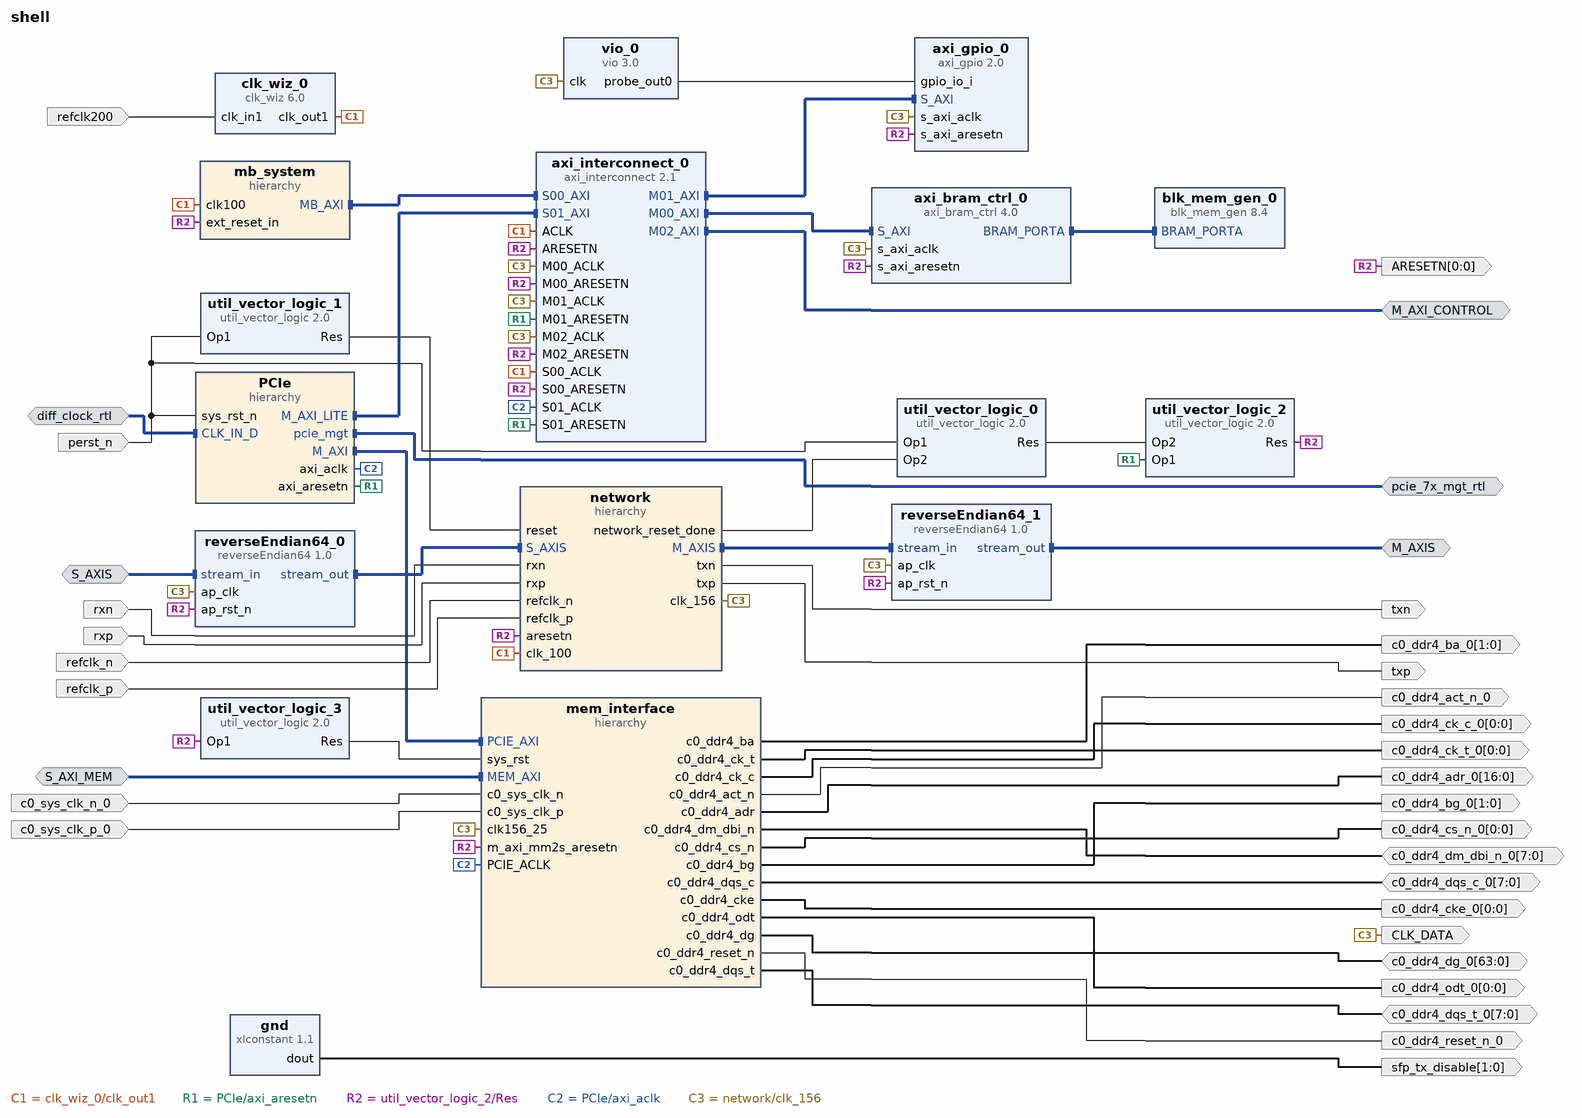
[diagram p0: block diagram of the top level]
# Vivado block design shell, xcku115-flva1517-2-e, Vivado 2018.1
create_bd_design shell

create_bd_intf_port -mode Master -vlnv xilinx.com:interface:pcie_7x_mgt_rtl:1.0 pcie_7x_mgt_rtl
create_bd_intf_port -mode Slave -vlnv xilinx.com:interface:diff_clock_rtl:1.0 diff_clock_rtl
set_property -dict {CONFIG.FREQ_HZ 100000000} [get_bd_intf_ports diff_clock_rtl]
create_bd_intf_port -mode Slave -vlnv xilinx.com:interface:axis_rtl:1.0 S_AXIS
set_property -dict [list \
  CONFIG.TDATA_NUM_BYTES 8 \
  CONFIG.TDEST_WIDTH 0 \
  CONFIG.TID_WIDTH 0 \
  CONFIG.TUSER_WIDTH 0 \
  CONFIG.HAS_TREADY 1 \
  CONFIG.HAS_TSTRB 0 \
  CONFIG.HAS_TKEEP 1 \
  CONFIG.HAS_TLAST 1 \
  CONFIG.LAYERED_METADATA {xilinx.com:interface:datatypes:1.0 {CLK {datatype {name {attribs {resolve_type immediate dependency {} format string minimum {} maximum {}} value {}} bitwidth {attribs {resolve_type immediate dependency {} format long minimum {} maximum {}} value 1} bitoffset {attribs {resolve_type immediate dependency {} format long minimum {} maximum {}} value 0}}} TDATA {datatype {name {attribs {resolve_type immediate dependency {} format string minimum {} maximum {}} value {}} bitwidth {attribs {resolve_type immediate dependency {} format long minimum {} maximum {}} value 64} bitoffset {attribs {resolve_type immediate dependency {} format long minimum {} maximum {}} value 0} integer {signed {attribs {resolve_type immediate dependency {} format bool minimum {} maximum {}} value true}}}} TDATA_WIDTH 64}} \
] [get_bd_intf_ports S_AXIS]
create_bd_intf_port -mode Master -vlnv xilinx.com:interface:aximm_rtl:1.0 M_AXI_CONTROL
set_property -dict [list \
  CONFIG.DATA_WIDTH 32 \
  CONFIG.PROTOCOL AXI4LITE \
  CONFIG.ADDR_WIDTH 32 \
  CONFIG.HAS_BURST 0 \
  CONFIG.HAS_LOCK 0 \
  CONFIG.HAS_CACHE 0 \
  CONFIG.HAS_QOS 0 \
  CONFIG.HAS_REGION 0 \
] [get_bd_intf_ports M_AXI_CONTROL]
create_bd_intf_port -mode Master -vlnv xilinx.com:interface:axis_rtl:1.0 M_AXIS
create_bd_intf_port -mode Slave -vlnv xilinx.com:interface:aximm_rtl:1.0 S_AXI_MEM
set_property -dict [list \
  CONFIG.DATA_WIDTH 512 \
  CONFIG.PROTOCOL AXI4 \
  CONFIG.ID_WIDTH 1 \
  CONFIG.ADDR_WIDTH 32 \
  CONFIG.AWUSER_WIDTH 0 \
  CONFIG.ARUSER_WIDTH 0 \
  CONFIG.WUSER_WIDTH 0 \
  CONFIG.RUSER_WIDTH 0 \
  CONFIG.BUSER_WIDTH 0 \
  CONFIG.READ_WRITE_MODE READ_WRITE \
  CONFIG.HAS_BURST 1 \
  CONFIG.HAS_LOCK 1 \
  CONFIG.HAS_PROT 1 \
  CONFIG.HAS_CACHE 1 \
  CONFIG.HAS_QOS 1 \
  CONFIG.HAS_REGION 1 \
  CONFIG.HAS_WSTRB 1 \
  CONFIG.HAS_BRESP 1 \
  CONFIG.HAS_RRESP 1 \
  CONFIG.SUPPORTS_NARROW_BURST 1 \
  CONFIG.NUM_READ_OUTSTANDING 2 \
  CONFIG.NUM_WRITE_OUTSTANDING 2 \
  CONFIG.MAX_BURST_LENGTH 256 \
  CONFIG.NUM_READ_THREADS 1 \
  CONFIG.NUM_WRITE_THREADS 1 \
  CONFIG.RUSER_BITS_PER_BYTE 0 \
  CONFIG.WUSER_BITS_PER_BYTE 0 \
] [get_bd_intf_ports S_AXI_MEM]
create_bd_port -dir I rxn
create_bd_port -dir I rxp
create_bd_port -dir I refclk_n
create_bd_port -dir O txp
create_bd_port -dir O txn
create_bd_port -dir I refclk_p
create_bd_port -dir I perst_n
create_bd_port -dir I -type clk refclk200
set_property -dict {CONFIG.FREQ_HZ 200000000} [get_bd_ports refclk200]
create_bd_port -dir O -from 1 -to 0 sfp_tx_disable
create_bd_port -dir O -from 0 -to 0 ARESETN
create_bd_port -dir O -type clk CLK_DATA
set_property -dict {CONFIG.ASSOCIATED_BUSIF M_AXIS:S_AXIS:S_AXI_MEM:M_AXI_CONTROL} [get_bd_ports CLK_DATA]
create_bd_port -dir O -from 1 -to 0 c0_ddr4_ba_0
create_bd_port -dir O -from 0 -to 0 -type clk c0_ddr4_ck_t_0
create_bd_port -dir O -from 0 -to 0 -type clk c0_ddr4_ck_c_0
create_bd_port -dir IO -from 7 -to 0 c0_ddr4_dm_dbi_n_0
create_bd_port -dir IO -from 7 -to 0 c0_ddr4_dqs_c_0
create_bd_port -dir O -from 0 -to 0 c0_ddr4_cs_n_0
create_bd_port -dir O -from 0 -to 0 c0_ddr4_odt_0
create_bd_port -dir O c0_ddr4_act_n_0
create_bd_port -dir O -from 1 -to 0 c0_ddr4_bg_0
create_bd_port -dir O -from 16 -to 0 c0_ddr4_adr_0
create_bd_port -dir O c0_ddr4_reset_n_0
create_bd_port -dir O -from 0 -to 0 c0_ddr4_cke_0
create_bd_port -dir IO -from 7 -to 0 c0_ddr4_dqs_t_0
create_bd_port -dir I -type clk c0_sys_clk_n_0
create_bd_port -dir I -type clk c0_sys_clk_p_0
create_bd_port -dir IO -from 63 -to 0 c0_ddr4_dg_0

create_bd_cell -type hier network
create_bd_cell -type ip -vlnv xilinx.com:ip:util_vector_logic:2.0 util_vector_logic_0
set_property -dict {CONFIG.C_SIZE 1} [get_bd_cells util_vector_logic_0]
create_bd_cell -type ip -vlnv xilinx.com:ip:util_vector_logic:2.0 util_vector_logic_1
set_property -dict {CONFIG.C_SIZE 1 CONFIG.C_OPERATION not} [get_bd_cells util_vector_logic_1]
create_bd_cell -type ip -vlnv xilinx.com:ip:clk_wiz:6.0 clk_wiz_0
set_property -dict {CONFIG.USE_LOCKED false CONFIG.USE_RESET false} [get_bd_cells clk_wiz_0]
create_bd_cell -type ip -vlnv xilinx.com:ip:xlconstant:1.1 gnd
set_property -dict {CONFIG.CONST_WIDTH 2 CONFIG.CONST_VAL 0} [get_bd_cells gnd]
create_bd_cell -type hier PCIe
create_bd_cell -type ip -vlnv xilinx.com:ip:util_vector_logic:2.0 util_vector_logic_2
set_property -dict {CONFIG.C_SIZE 1} [get_bd_cells util_vector_logic_2]
create_bd_cell -type hier mb_system
create_bd_cell -type ip -vlnv xilinx.com:ip:axi_interconnect:2.1 axi_interconnect_0
set_property -dict [list \
  CONFIG.NUM_SI 2 \
  CONFIG.NUM_MI 3 \
  CONFIG.ENABLE_ADVANCED_OPTIONS 0 \
  CONFIG.XBAR_DATA_WIDTH 32 \
] [get_bd_cells axi_interconnect_0]
create_bd_cell -type ip -vlnv xilinx.com:ip:axi_bram_ctrl:4.0 axi_bram_ctrl_0
set_property -dict {CONFIG.PROTOCOL AXI4LITE CONFIG.SINGLE_PORT_BRAM 1} [get_bd_cells axi_bram_ctrl_0]
create_bd_cell -type hier mem_interface
create_bd_cell -type ip -vlnv xilinx.com:ip:blk_mem_gen:8.4 blk_mem_gen_0
create_bd_cell -type ip -vlnv xilinx.com:hls:reverseEndian64:1.0 reverseEndian64_0
create_bd_cell -type ip -vlnv xilinx.com:hls:reverseEndian64:1.0 reverseEndian64_1
create_bd_cell -type ip -vlnv xilinx.com:ip:axi_gpio:2.0 axi_gpio_0
create_bd_cell -type ip -vlnv xilinx.com:ip:vio:3.0 vio_0
set_property -dict {CONFIG.C_PROBE_OUT0_WIDTH 32 CONFIG.C_NUM_PROBE_IN 0} [get_bd_cells vio_0]
create_bd_cell -type ip -vlnv xilinx.com:ip:util_vector_logic:2.0 util_vector_logic_3
set_property -dict {CONFIG.C_SIZE 1 CONFIG.C_OPERATION not} [get_bd_cells util_vector_logic_3]

# ---- hierarchy /network ----
current_bd_instance /network
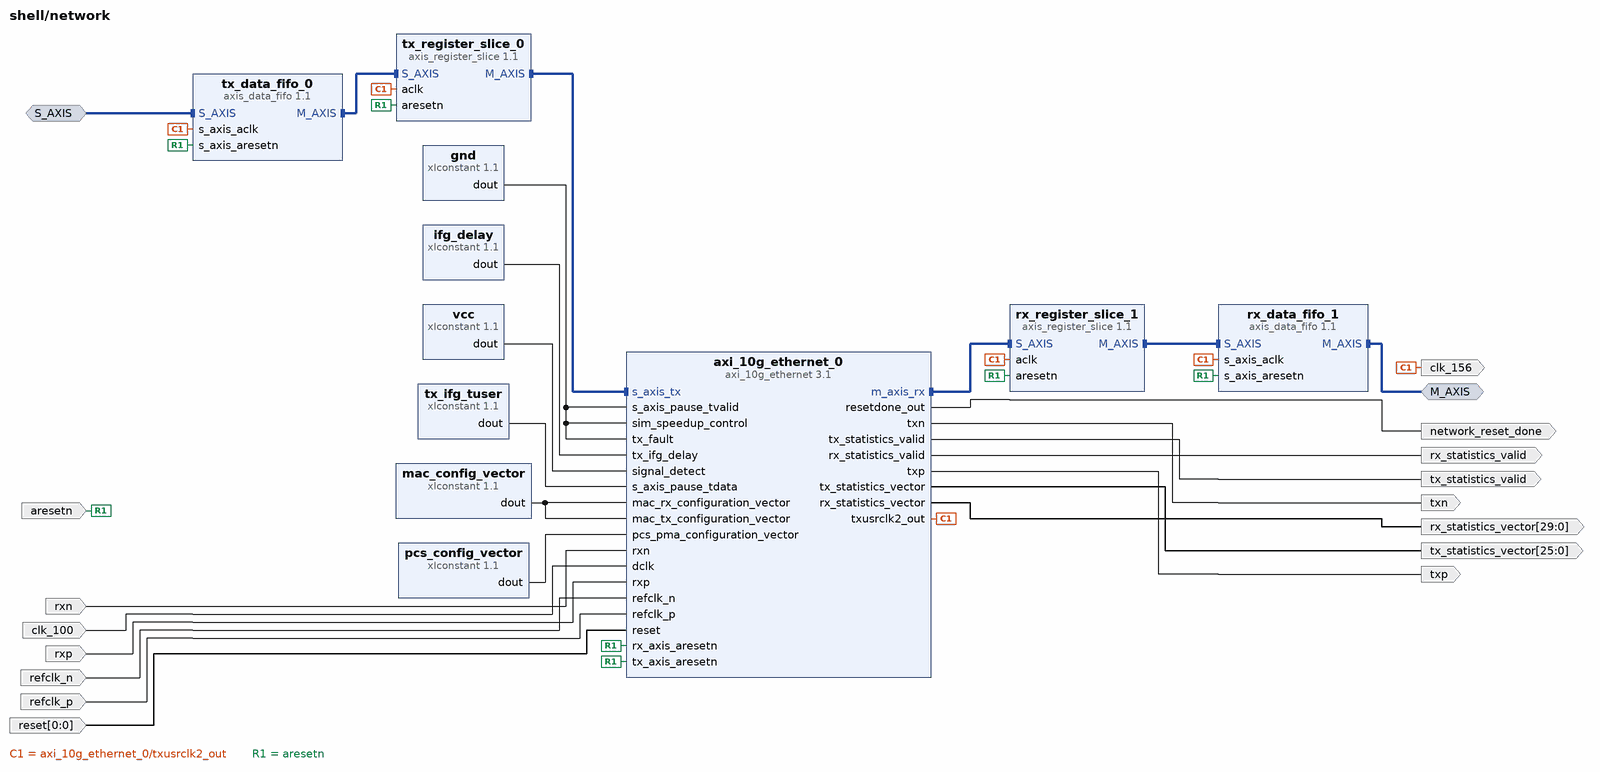
[diagram p1: block diagram inside /network]
create_bd_intf_pin -mode Slave -vlnv xilinx.com:interface:axis_rtl:1.0 S_AXIS
create_bd_intf_pin -mode Master -vlnv xilinx.com:interface:axis_rtl:1.0 M_AXIS
create_bd_pin -dir I rxn
create_bd_pin -dir I -type clk clk_100
create_bd_pin -dir I rxp
create_bd_pin -dir O -type clk clk_156
create_bd_pin -dir I -type rst aresetn
create_bd_pin -dir I refclk_n
create_bd_pin -dir O txp
create_bd_pin -dir O txn
create_bd_pin -dir O network_reset_done
create_bd_pin -dir I refclk_p
create_bd_pin -dir I -from 0 -to 0 -type rst reset
create_bd_pin -dir O tx_statistics_valid
create_bd_pin -dir O -from 25 -to 0 tx_statistics_vector
create_bd_pin -dir O rx_statistics_valid
create_bd_pin -dir O -from 29 -to 0 rx_statistics_vector

create_bd_cell -type ip -vlnv xilinx.com:ip:xlconstant:1.1 gnd
set_property -dict {CONFIG.CONST_VAL 0} [get_bd_cells gnd]
create_bd_cell -type ip -vlnv xilinx.com:ip:axis_register_slice:1.1 tx_register_slice_0
set_property -dict {CONFIG.TUSER_WIDTH 0} [get_bd_cells tx_register_slice_0]
create_bd_cell -type ip -vlnv xilinx.com:ip:axi_10g_ethernet:3.1 axi_10g_ethernet_0
set_property -dict [list \
  CONFIG.Management_Interface false \
  CONFIG.base_kr BASE-R \
  CONFIG.SupportLevel 1 \
  CONFIG.Locations X1Y16 \
] [get_bd_cells axi_10g_ethernet_0]
create_bd_cell -type ip -vlnv xilinx.com:ip:xlconstant:1.1 mac_config_vector
set_property -dict {CONFIG.CONST_WIDTH 80 CONFIG.CONST_VAL 22} [get_bd_cells mac_config_vector]
create_bd_cell -type ip -vlnv xilinx.com:ip:xlconstant:1.1 tx_ifg_tuser
set_property -dict {CONFIG.CONST_WIDTH 16 CONFIG.CONST_VAL 0} [get_bd_cells tx_ifg_tuser]
create_bd_cell -type ip -vlnv xilinx.com:ip:xlconstant:1.1 ifg_delay
set_property -dict {CONFIG.CONST_WIDTH 8 CONFIG.CONST_VAL 0} [get_bd_cells ifg_delay]
create_bd_cell -type ip -vlnv xilinx.com:ip:xlconstant:1.1 vcc
create_bd_cell -type ip -vlnv xilinx.com:ip:xlconstant:1.1 pcs_config_vector
set_property -dict {CONFIG.CONST_WIDTH 536 CONFIG.CONST_VAL 0} [get_bd_cells pcs_config_vector]
create_bd_cell -type ip -vlnv xilinx.com:ip:axis_register_slice:1.1 rx_register_slice_1
set_property -dict {CONFIG.TUSER_WIDTH 0} [get_bd_cells rx_register_slice_1]
create_bd_cell -type ip -vlnv xilinx.com:ip:axis_data_fifo:1.1 rx_data_fifo_1
set_property -dict {CONFIG.FIFO_MODE 2} [get_bd_cells rx_data_fifo_1]
create_bd_cell -type ip -vlnv xilinx.com:ip:axis_data_fifo:1.1 tx_data_fifo_0
set_property -dict {CONFIG.FIFO_MODE 2} [get_bd_cells tx_data_fifo_0]

# ---- hierarchy /PCIe ----
current_bd_instance /PCIe
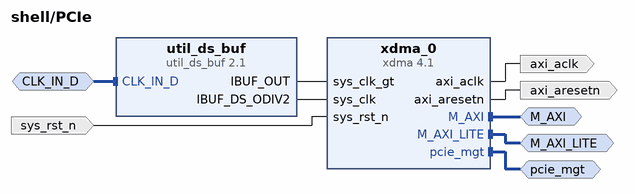
[diagram p2: block diagram inside /PCIe]
create_bd_intf_pin -mode Master -vlnv xilinx.com:interface:pcie_7x_mgt_rtl:1.0 pcie_mgt
create_bd_intf_pin -mode Master -vlnv xilinx.com:interface:aximm_rtl:1.0 M_AXI
create_bd_intf_pin -mode Slave -vlnv xilinx.com:interface:diff_clock_rtl:1.0 CLK_IN_D
create_bd_intf_pin -mode Master -vlnv xilinx.com:interface:aximm_rtl:1.0 M_AXI_LITE
create_bd_pin -dir I -type rst sys_rst_n
create_bd_pin -dir O -type clk axi_aclk
create_bd_pin -dir O -type rst axi_aresetn

create_bd_cell -type ip -vlnv xilinx.com:ip:xdma:4.1 xdma_0
set_property -dict [list \
  CONFIG.mode_selection Advanced \
  CONFIG.pl_link_cap_max_link_width X8 \
  CONFIG.pl_link_cap_max_link_speed 8.0_GT/s \
  CONFIG.axi_data_width 256_bit \
  CONFIG.axisten_freq 250 \
  CONFIG.pf0_device_id 8038 \
  CONFIG.axilite_master_en true \
  CONFIG.pf0_interrupt_pin NONE \
  CONFIG.xdma_rnum_chnl 4 \
  CONFIG.xdma_wnum_chnl 4 \
  CONFIG.INS_LOSS_NYQ 5 \
  CONFIG.xdma_axi_intf_mm AXI_Memory_Mapped \
  CONFIG.cfg_mgmt_if false \
  CONFIG.ins_loss_profile Chip-to-Chip \
] [get_bd_cells xdma_0]
create_bd_cell -type ip -vlnv xilinx.com:ip:util_ds_buf:2.1 util_ds_buf
set_property -dict {CONFIG.C_BUF_TYPE IBUFDSGTE} [get_bd_cells util_ds_buf]

# ---- hierarchy /mb_system ----
current_bd_instance /mb_system
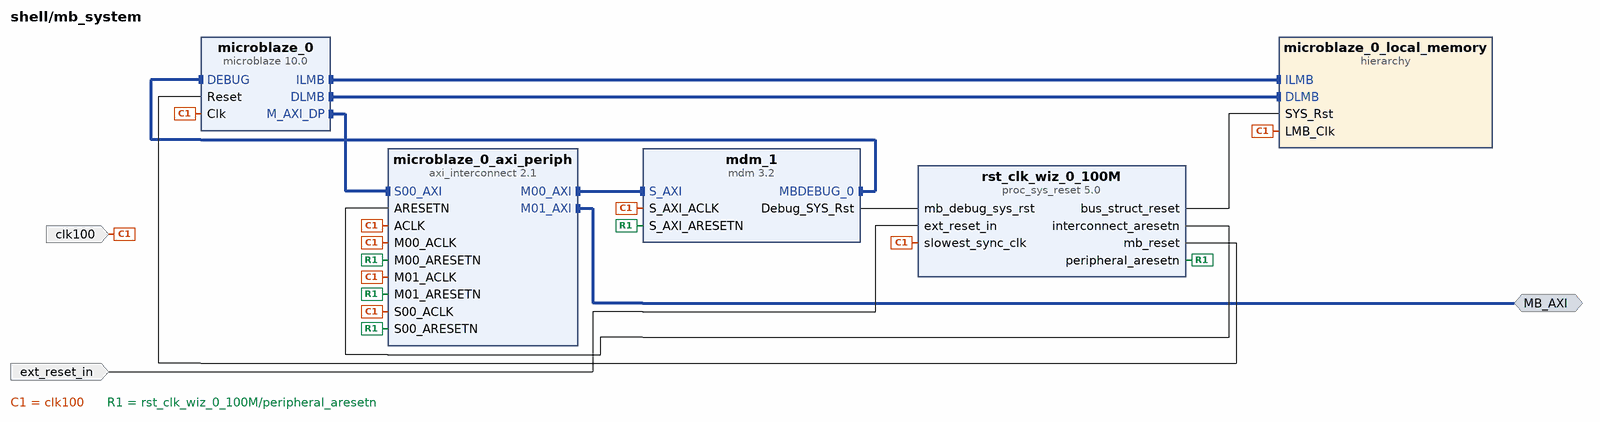
[diagram p3: block diagram inside /mb_system]
create_bd_intf_pin -mode Master -vlnv xilinx.com:interface:aximm_rtl:1.0 MB_AXI
create_bd_pin -dir I -type clk clk100
create_bd_pin -dir I -type rst ext_reset_in

create_bd_cell -type ip -vlnv xilinx.com:ip:mdm:3.2 mdm_1
set_property -dict {CONFIG.C_USE_UART 1} [get_bd_cells mdm_1]
create_bd_cell -type ip -vlnv xilinx.com:ip:proc_sys_reset:5.0 rst_clk_wiz_0_100M
create_bd_cell -type ip -vlnv xilinx.com:ip:axi_interconnect:2.1 microblaze_0_axi_periph
set_property -dict {CONFIG.NUM_MI 2} [get_bd_cells microblaze_0_axi_periph]
create_bd_cell -type ip -vlnv xilinx.com:ip:microblaze:10.0 microblaze_0
set_property -dict {CONFIG.C_D_AXI 1 CONFIG.C_D_LMB 1 CONFIG.C_I_LMB 1 CONFIG.C_DEBUG_ENABLED 1} [get_bd_cells microblaze_0]
create_bd_cell -type hier microblaze_0_local_memory

# ---- hierarchy /mb_system/microblaze_0_local_memory ----
current_bd_instance /mb_system/microblaze_0_local_memory
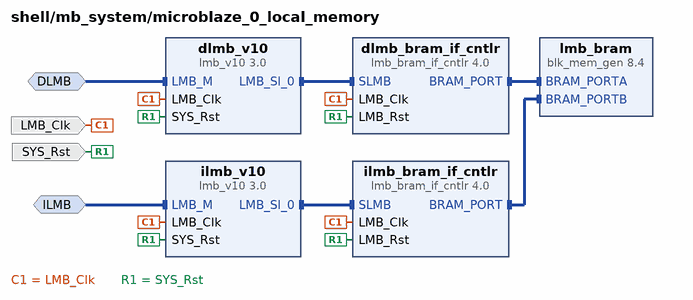
[diagram p4: block diagram inside /mb_system/microblaze_0_local_memory]
create_bd_intf_pin -mode MirroredMaster -vlnv xilinx.com:interface:lmb_rtl:1.0 DLMB
create_bd_intf_pin -mode MirroredMaster -vlnv xilinx.com:interface:lmb_rtl:1.0 ILMB
create_bd_pin -dir I -type clk LMB_Clk
create_bd_pin -dir I -type rst SYS_Rst

create_bd_cell -type ip -vlnv xilinx.com:ip:lmb_v10:3.0 dlmb_v10
create_bd_cell -type ip -vlnv xilinx.com:ip:lmb_v10:3.0 ilmb_v10
create_bd_cell -type ip -vlnv xilinx.com:ip:lmb_bram_if_cntlr:4.0 dlmb_bram_if_cntlr
set_property -dict {CONFIG.C_ECC 0} [get_bd_cells dlmb_bram_if_cntlr]
create_bd_cell -type ip -vlnv xilinx.com:ip:lmb_bram_if_cntlr:4.0 ilmb_bram_if_cntlr
set_property -dict {CONFIG.C_ECC 0} [get_bd_cells ilmb_bram_if_cntlr]
create_bd_cell -type ip -vlnv xilinx.com:ip:blk_mem_gen:8.4 lmb_bram
set_property -dict {CONFIG.Memory_Type True_Dual_Port_RAM CONFIG.use_bram_block BRAM_Controller} [get_bd_cells lmb_bram]

# ---- hierarchy /mem_interface ----
current_bd_instance /mem_interface
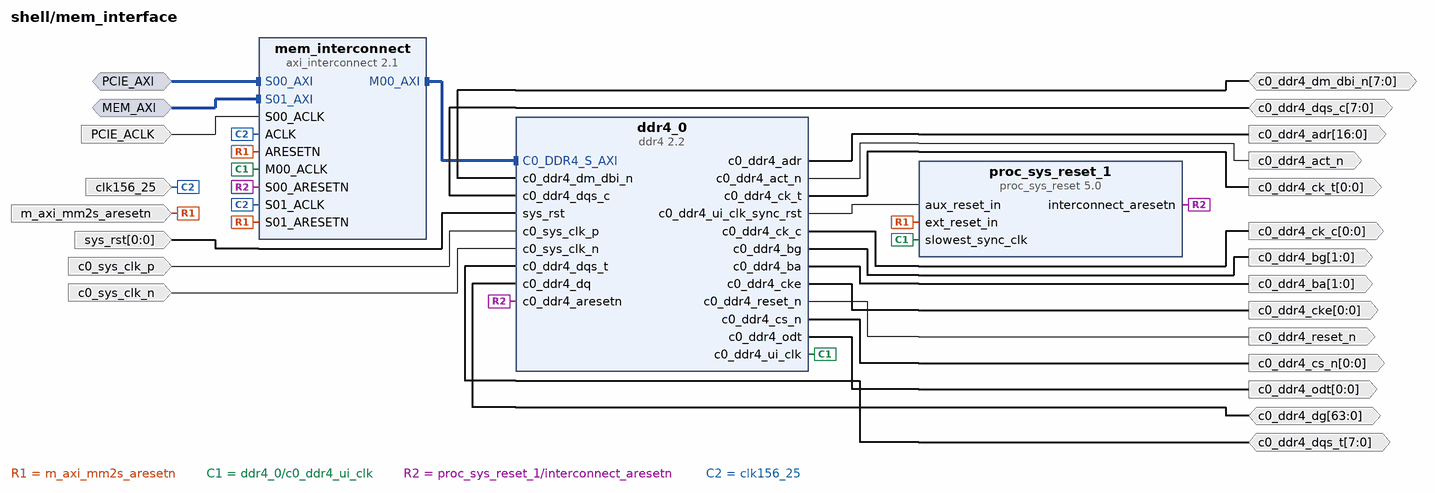
[diagram p5: block diagram inside /mem_interface]
create_bd_intf_pin -mode Slave -vlnv xilinx.com:interface:aximm_rtl:1.0 PCIE_AXI
create_bd_intf_pin -mode Slave -vlnv xilinx.com:interface:aximm_rtl:1.0 MEM_AXI
create_bd_pin -dir O c0_ddr4_reset_n
create_bd_pin -dir I -type clk clk156_25
create_bd_pin -dir O -from 1 -to 0 c0_ddr4_bg
create_bd_pin -dir O -from 0 -to 0 c0_ddr4_odt
create_bd_pin -dir O c0_ddr4_act_n
create_bd_pin -dir O -from 16 -to 0 c0_ddr4_adr
create_bd_pin -dir O -from 1 -to 0 c0_ddr4_ba
create_bd_pin -dir O -from 0 -to 0 c0_ddr4_cke
create_bd_pin -dir O -from 0 -to 0 -type clk c0_ddr4_ck_c
create_bd_pin -dir O -from 0 -to 0 -type clk c0_ddr4_ck_t
create_bd_pin -dir IO -from 7 -to 0 c0_ddr4_dqs_c
create_bd_pin -dir IO -from 7 -to 0 c0_ddr4_dm_dbi_n
create_bd_pin -dir IO -from 7 -to 0 c0_ddr4_dqs_t
create_bd_pin -dir O -from 0 -to 0 c0_ddr4_cs_n
create_bd_pin -dir I -type clk c0_sys_clk_p
create_bd_pin -dir I -type clk c0_sys_clk_n
create_bd_pin -dir I -type rst m_axi_mm2s_aresetn
create_bd_pin -dir I -type clk PCIE_ACLK
create_bd_pin -dir I -from 0 -to 0 -type rst sys_rst
create_bd_pin -dir IO -from 63 -to 0 c0_ddr4_dg

create_bd_cell -type ip -vlnv xilinx.com:ip:proc_sys_reset:5.0 proc_sys_reset_1
create_bd_cell -type ip -vlnv xilinx.com:ip:ddr4:2.2 ddr4_0
set_property -dict [list \
  CONFIG.C0.DDR4_TimePeriod 939 \
  CONFIG.C0.DDR4_InputClockPeriod 3338 \
  CONFIG.C0.DDR4_MemoryPart CUSTOM_DBI_MT40A1G8PM-083E \
  CONFIG.C0.DDR4_DataWidth 64 \
  CONFIG.C0.DDR4_CasLatency 18 \
  CONFIG.C0.DDR4_CasWriteLatency 11 \
  CONFIG.C0.DDR4_AxiDataWidth 512 \
  CONFIG.C0.DDR4_AxiAddressWidth 33 \
  CONFIG.C0.DDR4_CustomParts ../../../../imports/adm-8k5_flatten/constraints/custom_parts_2133.csv \
  CONFIG.C0.DDR4_isCustom true \
  CONFIG.Simulation_Mode Unisim \
  CONFIG.C0.ADDR_WIDTH 17 \
  CONFIG.C0.BANK_GROUP_WIDTH 2 \
] [get_bd_cells ddr4_0]
create_bd_cell -type ip -vlnv xilinx.com:ip:axi_interconnect:2.1 mem_interconnect
set_property -dict [list \
  CONFIG.NUM_SI 2 \
  CONFIG.NUM_MI 1 \
  CONFIG.STRATEGY 2 \
  CONFIG.ENABLE_ADVANCED_OPTIONS 1 \
  CONFIG.XBAR_DATA_WIDTH 512 \
  CONFIG.SYNCHRONIZATION_STAGES 3 \
  CONFIG.M00_HAS_REGSLICE 3 \
  CONFIG.S00_HAS_REGSLICE 3 \
  CONFIG.S01_HAS_REGSLICE 3 \
  CONFIG.S02_HAS_REGSLICE 3 \
  CONFIG.S03_HAS_REGSLICE 3 \
  CONFIG.S00_HAS_DATA_FIFO 2 \
  CONFIG.S01_HAS_DATA_FIFO 2 \
  CONFIG.S02_HAS_DATA_FIFO 2 \
] [get_bd_cells mem_interconnect]

# ---- connections ----

current_bd_instance /network
connect_bd_intf_net -intf_net axis_register_slice_0_M_AXIS [get_bd_intf_pins tx_register_slice_0/M_AXIS] [get_bd_intf_pins axi_10g_ethernet_0/s_axis_tx]
connect_bd_intf_net [get_bd_intf_pins axi_10g_ethernet_0/m_axis_rx] [get_bd_intf_pins rx_register_slice_1/S_AXIS]
connect_bd_intf_net -intf_net axis_register_slice_1_M_AXIS [get_bd_intf_pins rx_register_slice_1/M_AXIS] [get_bd_intf_pins rx_data_fifo_1/S_AXIS]
connect_bd_intf_net -intf_net axis_data_fifo_0_M_AXIS [get_bd_intf_pins tx_data_fifo_0/M_AXIS] [get_bd_intf_pins tx_register_slice_0/S_AXIS]
connect_bd_intf_net [get_bd_intf_pins S_AXIS] [get_bd_intf_pins tx_data_fifo_0/S_AXIS]
connect_bd_intf_net [get_bd_intf_pins M_AXIS] [get_bd_intf_pins rx_data_fifo_1/M_AXIS]
connect_bd_net [get_bd_pins gnd/dout] \
  [get_bd_pins axi_10g_ethernet_0/s_axis_pause_tvalid] [get_bd_pins axi_10g_ethernet_0/tx_fault] \
  [get_bd_pins axi_10g_ethernet_0/sim_speedup_control]
connect_bd_net [get_bd_pins ifg_delay/dout] [get_bd_pins axi_10g_ethernet_0/tx_ifg_delay]
connect_bd_net [get_bd_pins vcc/dout] [get_bd_pins axi_10g_ethernet_0/signal_detect]
connect_bd_net [get_bd_pins tx_ifg_tuser/dout] [get_bd_pins axi_10g_ethernet_0/s_axis_pause_tdata]
connect_bd_net [get_bd_pins mac_config_vector/dout] \
  [get_bd_pins axi_10g_ethernet_0/mac_tx_configuration_vector] [get_bd_pins axi_10g_ethernet_0/mac_rx_configuration_vector]
connect_bd_net [get_bd_pins pcs_config_vector/dout] [get_bd_pins axi_10g_ethernet_0/pcs_pma_configuration_vector]
connect_bd_net [get_bd_pins rxn] [get_bd_pins axi_10g_ethernet_0/rxn]
connect_bd_net -net dclk_1 [get_bd_pins clk_100] [get_bd_pins axi_10g_ethernet_0/dclk]
connect_bd_net [get_bd_pins rxp] [get_bd_pins axi_10g_ethernet_0/rxp]
connect_bd_net [get_bd_pins axi_10g_ethernet_0/txusrclk2_out] \
  [get_bd_pins clk_156] [get_bd_pins rx_register_slice_1/aclk] [get_bd_pins tx_register_slice_0/aclk] \
  [get_bd_pins rx_data_fifo_1/s_axis_aclk] [get_bd_pins tx_data_fifo_0/s_axis_aclk]
connect_bd_net -net tx_axis_aresetn_1 [get_bd_pins aresetn] \
  [get_bd_pins axi_10g_ethernet_0/tx_axis_aresetn] [get_bd_pins axi_10g_ethernet_0/rx_axis_aresetn] \
  [get_bd_pins rx_register_slice_1/aresetn] [get_bd_pins tx_register_slice_0/aresetn] \
  [get_bd_pins rx_data_fifo_1/s_axis_aresetn] [get_bd_pins tx_data_fifo_0/s_axis_aresetn]
connect_bd_net [get_bd_pins refclk_n] [get_bd_pins axi_10g_ethernet_0/refclk_n]
connect_bd_net [get_bd_pins axi_10g_ethernet_0/txp] [get_bd_pins txp]
connect_bd_net [get_bd_pins axi_10g_ethernet_0/txn] [get_bd_pins txn]
connect_bd_net [get_bd_pins axi_10g_ethernet_0/resetdone_out] [get_bd_pins network_reset_done]
connect_bd_net [get_bd_pins refclk_p] [get_bd_pins axi_10g_ethernet_0/refclk_p]
connect_bd_net [get_bd_pins axi_10g_ethernet_0/tx_statistics_valid] [get_bd_pins tx_statistics_valid]
connect_bd_net [get_bd_pins axi_10g_ethernet_0/tx_statistics_vector] [get_bd_pins tx_statistics_vector]
connect_bd_net [get_bd_pins axi_10g_ethernet_0/rx_statistics_valid] [get_bd_pins rx_statistics_valid]
connect_bd_net [get_bd_pins axi_10g_ethernet_0/rx_statistics_vector] [get_bd_pins rx_statistics_vector]
connect_bd_net [get_bd_pins reset] [get_bd_pins axi_10g_ethernet_0/reset]

current_bd_instance /PCIe
connect_bd_intf_net [get_bd_intf_pins pcie_mgt] [get_bd_intf_pins xdma_0/pcie_mgt]
connect_bd_intf_net [get_bd_intf_pins M_AXI] [get_bd_intf_pins xdma_0/M_AXI]
connect_bd_intf_net [get_bd_intf_pins CLK_IN_D] [get_bd_intf_pins util_ds_buf/CLK_IN_D]
connect_bd_intf_net [get_bd_intf_pins M_AXI_LITE] [get_bd_intf_pins xdma_0/M_AXI_LITE]
connect_bd_net [get_bd_pins sys_rst_n] [get_bd_pins xdma_0/sys_rst_n]
connect_bd_net [get_bd_pins xdma_0/axi_aclk] [get_bd_pins axi_aclk]
connect_bd_net [get_bd_pins xdma_0/axi_aresetn] [get_bd_pins axi_aresetn]
connect_bd_net [get_bd_pins util_ds_buf/IBUF_OUT] [get_bd_pins xdma_0/sys_clk_gt]
connect_bd_net [get_bd_pins util_ds_buf/IBUF_DS_ODIV2] [get_bd_pins xdma_0/sys_clk]

current_bd_instance /mb_system
connect_bd_intf_net [get_bd_intf_pins mdm_1/S_AXI] [get_bd_intf_pins microblaze_0_axi_periph/M00_AXI]
connect_bd_intf_net [get_bd_intf_pins microblaze_0/M_AXI_DP] [get_bd_intf_pins microblaze_0_axi_periph/S00_AXI]
connect_bd_intf_net [get_bd_intf_pins microblaze_0/DEBUG] [get_bd_intf_pins mdm_1/MBDEBUG_0]
connect_bd_intf_net [get_bd_intf_pins microblaze_0/ILMB] [get_bd_intf_pins microblaze_0_local_memory/ILMB]
connect_bd_intf_net [get_bd_intf_pins microblaze_0/DLMB] [get_bd_intf_pins microblaze_0_local_memory/DLMB]
connect_bd_intf_net [get_bd_intf_pins MB_AXI] [get_bd_intf_pins microblaze_0_axi_periph/M01_AXI]
connect_bd_net [get_bd_pins clk100] \
  [get_bd_pins mdm_1/S_AXI_ACLK] [get_bd_pins rst_clk_wiz_0_100M/slowest_sync_clk] [get_bd_pins microblaze_0/Clk] \
  [get_bd_pins microblaze_0_axi_periph/ACLK] [get_bd_pins microblaze_0_axi_periph/M01_ACLK] \
  [get_bd_pins microblaze_0_axi_periph/M00_ACLK] [get_bd_pins microblaze_0_axi_periph/S00_ACLK] \
  [get_bd_pins microblaze_0_local_memory/LMB_Clk]
connect_bd_net -net ap_rst_n_1 [get_bd_pins rst_clk_wiz_0_100M/peripheral_aresetn] \
  [get_bd_pins mdm_1/S_AXI_ARESETN] [get_bd_pins microblaze_0_axi_periph/S00_ARESETN] \
  [get_bd_pins microblaze_0_axi_periph/M01_ARESETN] [get_bd_pins microblaze_0_axi_periph/M00_ARESETN]
connect_bd_net [get_bd_pins mdm_1/Debug_SYS_Rst] [get_bd_pins rst_clk_wiz_0_100M/mb_debug_sys_rst]
connect_bd_net [get_bd_pins ext_reset_in] [get_bd_pins rst_clk_wiz_0_100M/ext_reset_in]
connect_bd_net [get_bd_pins rst_clk_wiz_0_100M/interconnect_aresetn] [get_bd_pins microblaze_0_axi_periph/ARESETN]
connect_bd_net [get_bd_pins rst_clk_wiz_0_100M/mb_reset] [get_bd_pins microblaze_0/Reset]
connect_bd_net [get_bd_pins rst_clk_wiz_0_100M/bus_struct_reset] [get_bd_pins microblaze_0_local_memory/SYS_Rst]

current_bd_instance /mb_system/microblaze_0_local_memory
connect_bd_intf_net -intf_net microblaze_0_dlmb_bus [get_bd_intf_pins dlmb_v10/LMB_Sl_0] [get_bd_intf_pins dlmb_bram_if_cntlr/SLMB]
connect_bd_intf_net -intf_net microblaze_0_ilmb_bus [get_bd_intf_pins ilmb_v10/LMB_Sl_0] [get_bd_intf_pins ilmb_bram_if_cntlr/SLMB]
connect_bd_intf_net -intf_net microblaze_0_dlmb_cntlr [get_bd_intf_pins dlmb_bram_if_cntlr/BRAM_PORT] [get_bd_intf_pins lmb_bram/BRAM_PORTA]
connect_bd_intf_net -intf_net microblaze_0_ilmb_cntlr [get_bd_intf_pins ilmb_bram_if_cntlr/BRAM_PORT] [get_bd_intf_pins lmb_bram/BRAM_PORTB]
connect_bd_intf_net -intf_net microblaze_0_dlmb [get_bd_intf_pins DLMB] [get_bd_intf_pins dlmb_v10/LMB_M]
connect_bd_intf_net -intf_net microblaze_0_ilmb [get_bd_intf_pins ILMB] [get_bd_intf_pins ilmb_v10/LMB_M]
connect_bd_net -net microblaze_0_Clk [get_bd_pins LMB_Clk] \
  [get_bd_pins dlmb_v10/LMB_Clk] [get_bd_pins dlmb_bram_if_cntlr/LMB_Clk] [get_bd_pins ilmb_v10/LMB_Clk] \
  [get_bd_pins ilmb_bram_if_cntlr/LMB_Clk]
connect_bd_net [get_bd_pins SYS_Rst] \
  [get_bd_pins dlmb_v10/SYS_Rst] [get_bd_pins dlmb_bram_if_cntlr/LMB_Rst] [get_bd_pins ilmb_v10/SYS_Rst] \
  [get_bd_pins ilmb_bram_if_cntlr/LMB_Rst]

current_bd_instance /mem_interface
connect_bd_intf_net -intf_net pcie_interconnect_M00_AXI [get_bd_intf_pins mem_interconnect/M00_AXI] [get_bd_intf_pins ddr4_0/C0_DDR4_S_AXI]
connect_bd_intf_net [get_bd_intf_pins PCIE_AXI] [get_bd_intf_pins mem_interconnect/S00_AXI]
connect_bd_intf_net [get_bd_intf_pins MEM_AXI] [get_bd_intf_pins mem_interconnect/S01_AXI]
connect_bd_net [get_bd_pins m_axi_mm2s_aresetn] \
  [get_bd_pins proc_sys_reset_1/ext_reset_in] [get_bd_pins mem_interconnect/ARESETN] \
  [get_bd_pins mem_interconnect/S01_ARESETN]
connect_bd_net [get_bd_pins sys_rst] [get_bd_pins ddr4_0/sys_rst]
connect_bd_net -net ddr4_1_c0_ddr4_ui_clk [get_bd_pins ddr4_0/c0_ddr4_ui_clk] \
  [get_bd_pins proc_sys_reset_1/slowest_sync_clk] [get_bd_pins mem_interconnect/M00_ACLK]
connect_bd_net -net ddr4_1_c0_ddr4_ck_t [get_bd_pins ddr4_0/c0_ddr4_ck_t] [get_bd_pins c0_ddr4_ck_t]
connect_bd_net [get_bd_pins c0_ddr4_dqs_c] [get_bd_pins ddr4_0/c0_ddr4_dqs_c]
connect_bd_net -net ddr4_1_c0_ddr4_adr [get_bd_pins ddr4_0/c0_ddr4_adr] [get_bd_pins c0_ddr4_adr]
connect_bd_net -net c1_sys_clk_p_1 [get_bd_pins c0_sys_clk_p] [get_bd_pins ddr4_0/c0_sys_clk_p]
connect_bd_net -net ddr4_1_c0_ddr4_ui_clk_sync_rst [get_bd_pins ddr4_0/c0_ddr4_ui_clk_sync_rst] [get_bd_pins proc_sys_reset_1/aux_reset_in]
connect_bd_net -net ddr4_1_c0_ddr4_ck_c [get_bd_pins ddr4_0/c0_ddr4_ck_c] [get_bd_pins c0_ddr4_ck_c]
connect_bd_net -net ddr4_1_c0_ddr4_act_n [get_bd_pins ddr4_0/c0_ddr4_act_n] [get_bd_pins c0_ddr4_act_n]
connect_bd_net -net ddr4_1_c0_ddr4_reset_n [get_bd_pins ddr4_0/c0_ddr4_reset_n] [get_bd_pins c0_ddr4_reset_n]
connect_bd_net [get_bd_pins c0_ddr4_dm_dbi_n] [get_bd_pins ddr4_0/c0_ddr4_dm_dbi_n]
connect_bd_net -net c1_sys_clk_n_1 [get_bd_pins c0_sys_clk_n] [get_bd_pins ddr4_0/c0_sys_clk_n]
connect_bd_net [get_bd_pins proc_sys_reset_1/interconnect_aresetn] [get_bd_pins ddr4_0/c0_ddr4_aresetn] [get_bd_pins mem_interconnect/S00_ARESETN]
connect_bd_net -net ddr4_1_c0_ddr4_bg [get_bd_pins ddr4_0/c0_ddr4_bg] [get_bd_pins c0_ddr4_bg]
connect_bd_net -net ddr4_1_c0_ddr4_odt [get_bd_pins ddr4_0/c0_ddr4_odt] [get_bd_pins c0_ddr4_odt]
connect_bd_net -net ddr4_1_c0_ddr4_cs_n [get_bd_pins ddr4_0/c0_ddr4_cs_n] [get_bd_pins c0_ddr4_cs_n]
connect_bd_net [get_bd_pins c0_ddr4_dqs_t] [get_bd_pins ddr4_0/c0_ddr4_dqs_t]
connect_bd_net -net ddr4_1_c0_ddr4_cke [get_bd_pins ddr4_0/c0_ddr4_cke] [get_bd_pins c0_ddr4_cke]
connect_bd_net -net ddr4_1_c0_ddr4_ba [get_bd_pins ddr4_0/c0_ddr4_ba] [get_bd_pins c0_ddr4_ba]
connect_bd_net -net S00_ACLK_1 [get_bd_pins PCIE_ACLK] [get_bd_pins mem_interconnect/S00_ACLK]
connect_bd_net -net m_axi_mm2s_aclk_1 [get_bd_pins clk156_25] [get_bd_pins mem_interconnect/ACLK] [get_bd_pins mem_interconnect/S01_ACLK]
connect_bd_net [get_bd_pins c0_ddr4_dg] [get_bd_pins ddr4_0/c0_ddr4_dq]

current_bd_instance /
connect_bd_intf_net [get_bd_intf_pins reverseEndian64_0/stream_out] [get_bd_intf_pins network/S_AXIS]
connect_bd_intf_net [get_bd_intf_pins axi_interconnect_0/S00_AXI] [get_bd_intf_pins mb_system/MB_AXI]
connect_bd_intf_net [get_bd_intf_pins PCIe/M_AXI] [get_bd_intf_pins mem_interface/PCIE_AXI]
connect_bd_intf_net [get_bd_intf_pins axi_interconnect_0/S01_AXI] [get_bd_intf_pins PCIe/M_AXI_LITE]
connect_bd_intf_net [get_bd_intf_pins blk_mem_gen_0/BRAM_PORTA] [get_bd_intf_pins axi_bram_ctrl_0/BRAM_PORTA]
connect_bd_intf_net [get_bd_intf_pins axi_bram_ctrl_0/S_AXI] [get_bd_intf_pins axi_interconnect_0/M00_AXI]
connect_bd_intf_net [get_bd_intf_pins network/M_AXIS] [get_bd_intf_pins reverseEndian64_1/stream_in]
connect_bd_intf_net [get_bd_intf_pins axi_interconnect_0/M01_AXI] [get_bd_intf_pins axi_gpio_0/S_AXI]
connect_bd_intf_net [get_bd_intf_ports pcie_7x_mgt_rtl] [get_bd_intf_pins PCIe/pcie_mgt]
connect_bd_intf_net [get_bd_intf_ports diff_clock_rtl] [get_bd_intf_pins PCIe/CLK_IN_D]
connect_bd_intf_net [get_bd_intf_ports S_AXIS] [get_bd_intf_pins reverseEndian64_0/stream_in]
connect_bd_intf_net [get_bd_intf_ports M_AXI_CONTROL] [get_bd_intf_pins axi_interconnect_0/M02_AXI]
connect_bd_intf_net [get_bd_intf_ports M_AXIS] [get_bd_intf_pins reverseEndian64_1/stream_out]
connect_bd_intf_net [get_bd_intf_ports S_AXI_MEM] [get_bd_intf_pins mem_interface/MEM_AXI]
connect_bd_net [get_bd_ports rxn] [get_bd_pins network/rxn]
connect_bd_net [get_bd_ports rxp] [get_bd_pins network/rxp]
connect_bd_net [get_bd_ports refclk_n] [get_bd_pins network/refclk_n]
connect_bd_net [get_bd_pins network/txp] [get_bd_ports txp]
connect_bd_net [get_bd_pins network/txn] [get_bd_ports txn]
connect_bd_net [get_bd_ports refclk_p] [get_bd_pins network/refclk_p]
connect_bd_net [get_bd_ports perst_n] [get_bd_pins util_vector_logic_0/Op1] [get_bd_pins util_vector_logic_1/Op1] [get_bd_pins PCIe/sys_rst_n]
connect_bd_net [get_bd_pins network/network_reset_done] [get_bd_pins util_vector_logic_0/Op2]
connect_bd_net [get_bd_pins util_vector_logic_1/Res] [get_bd_pins network/reset]
connect_bd_net -net refclk200_1 [get_bd_ports refclk200] [get_bd_pins clk_wiz_0/clk_in1]
connect_bd_net -net microblaze_0_Clk [get_bd_pins clk_wiz_0/clk_out1] \
  [get_bd_pins network/clk_100] [get_bd_pins mb_system/clk100] [get_bd_pins axi_interconnect_0/ACLK] \
  [get_bd_pins axi_interconnect_0/S00_ACLK]
connect_bd_net [get_bd_pins gnd/dout] [get_bd_ports sfp_tx_disable]
connect_bd_net [get_bd_pins PCIe/axi_aresetn] \
  [get_bd_pins util_vector_logic_2/Op1] [get_bd_pins axi_interconnect_0/M01_ARESETN] \
  [get_bd_pins axi_interconnect_0/S01_ARESETN]
connect_bd_net [get_bd_pins util_vector_logic_0/Res] [get_bd_pins util_vector_logic_2/Op2]
connect_bd_net [get_bd_pins util_vector_logic_2/Res] \
  [get_bd_ports ARESETN] [get_bd_pins axi_bram_ctrl_0/s_axi_aresetn] [get_bd_pins reverseEndian64_0/ap_rst_n] \
  [get_bd_pins reverseEndian64_1/ap_rst_n] [get_bd_pins axi_gpio_0/s_axi_aresetn] [get_bd_pins util_vector_logic_3/Op1] \
  [get_bd_pins network/aresetn] [get_bd_pins mb_system/ext_reset_in] [get_bd_pins axi_interconnect_0/ARESETN] \
  [get_bd_pins axi_interconnect_0/S00_ARESETN] [get_bd_pins axi_interconnect_0/M00_ARESETN] \
  [get_bd_pins mem_interface/m_axi_mm2s_aresetn] [get_bd_pins axi_interconnect_0/M02_ARESETN]
connect_bd_net [get_bd_pins PCIe/axi_aclk] [get_bd_pins axi_interconnect_0/S01_ACLK] [get_bd_pins mem_interface/PCIE_ACLK]
connect_bd_net [get_bd_pins network/clk_156] \
  [get_bd_ports CLK_DATA] [get_bd_pins reverseEndian64_0/ap_clk] [get_bd_pins reverseEndian64_1/ap_clk] \
  [get_bd_pins axi_bram_ctrl_0/s_axi_aclk] [get_bd_pins axi_gpio_0/s_axi_aclk] [get_bd_pins vio_0/clk] \
  [get_bd_pins mem_interface/clk156_25] [get_bd_pins axi_interconnect_0/M02_ACLK] [get_bd_pins axi_interconnect_0/M01_ACLK] \
  [get_bd_pins axi_interconnect_0/M00_ACLK]
connect_bd_net [get_bd_pins mem_interface/c0_ddr4_ba] [get_bd_ports c0_ddr4_ba_0]
connect_bd_net [get_bd_pins mem_interface/c0_ddr4_ck_t] [get_bd_ports c0_ddr4_ck_t_0]
connect_bd_net [get_bd_pins mem_interface/c0_ddr4_ck_c] [get_bd_ports c0_ddr4_ck_c_0]
connect_bd_net [get_bd_ports c0_ddr4_dm_dbi_n_0] [get_bd_pins mem_interface/c0_ddr4_dm_dbi_n]
connect_bd_net [get_bd_ports c0_ddr4_dqs_c_0] [get_bd_pins mem_interface/c0_ddr4_dqs_c]
connect_bd_net [get_bd_pins mem_interface/c0_ddr4_cs_n] [get_bd_ports c0_ddr4_cs_n_0]
connect_bd_net [get_bd_pins mem_interface/c0_ddr4_odt] [get_bd_ports c0_ddr4_odt_0]
connect_bd_net [get_bd_pins mem_interface/c0_ddr4_act_n] [get_bd_ports c0_ddr4_act_n_0]
connect_bd_net [get_bd_pins mem_interface/c0_ddr4_bg] [get_bd_ports c0_ddr4_bg_0]
connect_bd_net [get_bd_pins mem_interface/c0_ddr4_adr] [get_bd_ports c0_ddr4_adr_0]
connect_bd_net [get_bd_pins mem_interface/c0_ddr4_reset_n] [get_bd_ports c0_ddr4_reset_n_0]
connect_bd_net [get_bd_pins mem_interface/c0_ddr4_cke] [get_bd_ports c0_ddr4_cke_0]
connect_bd_net [get_bd_ports c0_ddr4_dqs_t_0] [get_bd_pins mem_interface/c0_ddr4_dqs_t]
connect_bd_net -net c0_sys_clk_n_0_1 [get_bd_ports c0_sys_clk_n_0] [get_bd_pins mem_interface/c0_sys_clk_n]
connect_bd_net -net c0_sys_clk_p_0_1 [get_bd_ports c0_sys_clk_p_0] [get_bd_pins mem_interface/c0_sys_clk_p]
connect_bd_net [get_bd_ports c0_ddr4_dg_0] [get_bd_pins mem_interface/c0_ddr4_dg]
connect_bd_net [get_bd_pins vio_0/probe_out0] [get_bd_pins axi_gpio_0/gpio_io_i]
connect_bd_net -net sys_rst_1 [get_bd_pins util_vector_logic_3/Res] [get_bd_pins mem_interface/sys_rst]

# ---- address map ----
assign_bd_address -offset 0x00000000 -range 8K -target_address_space [get_bd_addr_spaces mb_system/microblaze_0/Data] [get_bd_addr_segs mb_system/microblaze_0_local_memory/dlmb_bram_if_cntlr/SLMB/Mem]
assign_bd_address -offset 0x00090000 -range 64K -target_address_space [get_bd_addr_spaces mb_system/microblaze_0/Data] [get_bd_addr_segs axi_gpio_0/S_AXI/Reg]
assign_bd_address -offset 0x41400000 -range 4K -target_address_space [get_bd_addr_spaces mb_system/microblaze_0/Data] [get_bd_addr_segs mb_system/mdm_1/S_AXI/Reg]
assign_bd_address -offset 0x44A00000 -range 64K -target_address_space [get_bd_addr_spaces mb_system/microblaze_0/Data] [get_bd_addr_segs M_AXI_CONTROL/Reg]
assign_bd_address -offset 0xC0000000 -range 4K -target_address_space [get_bd_addr_spaces mb_system/microblaze_0/Data] [get_bd_addr_segs axi_bram_ctrl_0/S_AXI/Mem0]
assign_bd_address -offset 0x00000000 -range 8K -target_address_space [get_bd_addr_spaces mb_system/microblaze_0/Instruction] [get_bd_addr_segs mb_system/microblaze_0_local_memory/ilmb_bram_if_cntlr/SLMB/Mem]
assign_bd_address -offset 0x0000000000000000 -range 1G -target_address_space [get_bd_addr_spaces PCIe/xdma_0/M_AXI] [get_bd_addr_segs mem_interface/ddr4_0/C0_DDR4_MEMORY_MAP/C0_DDR4_ADDRESS_BLOCK]
assign_bd_address -offset 0x00090000 -range 64K -target_address_space [get_bd_addr_spaces PCIe/xdma_0/M_AXI_LITE] [get_bd_addr_segs axi_gpio_0/S_AXI/Reg]
assign_bd_address -offset 0x44A00000 -range 64K -target_address_space [get_bd_addr_spaces PCIe/xdma_0/M_AXI_LITE] [get_bd_addr_segs M_AXI_CONTROL/Reg]
assign_bd_address -offset 0xC0000000 -range 4K -target_address_space [get_bd_addr_spaces PCIe/xdma_0/M_AXI_LITE] [get_bd_addr_segs axi_bram_ctrl_0/S_AXI/Mem0]
assign_bd_address -offset 0x00000000 -range 1G -target_address_space [get_bd_addr_spaces S_AXI_MEM] [get_bd_addr_segs mem_interface/ddr4_0/C0_DDR4_MEMORY_MAP/C0_DDR4_ADDRESS_BLOCK]

validate_bd_design
save_bd_design
